# EAGLE design magspoof (EAGLE 7.7.0)
REV: 3
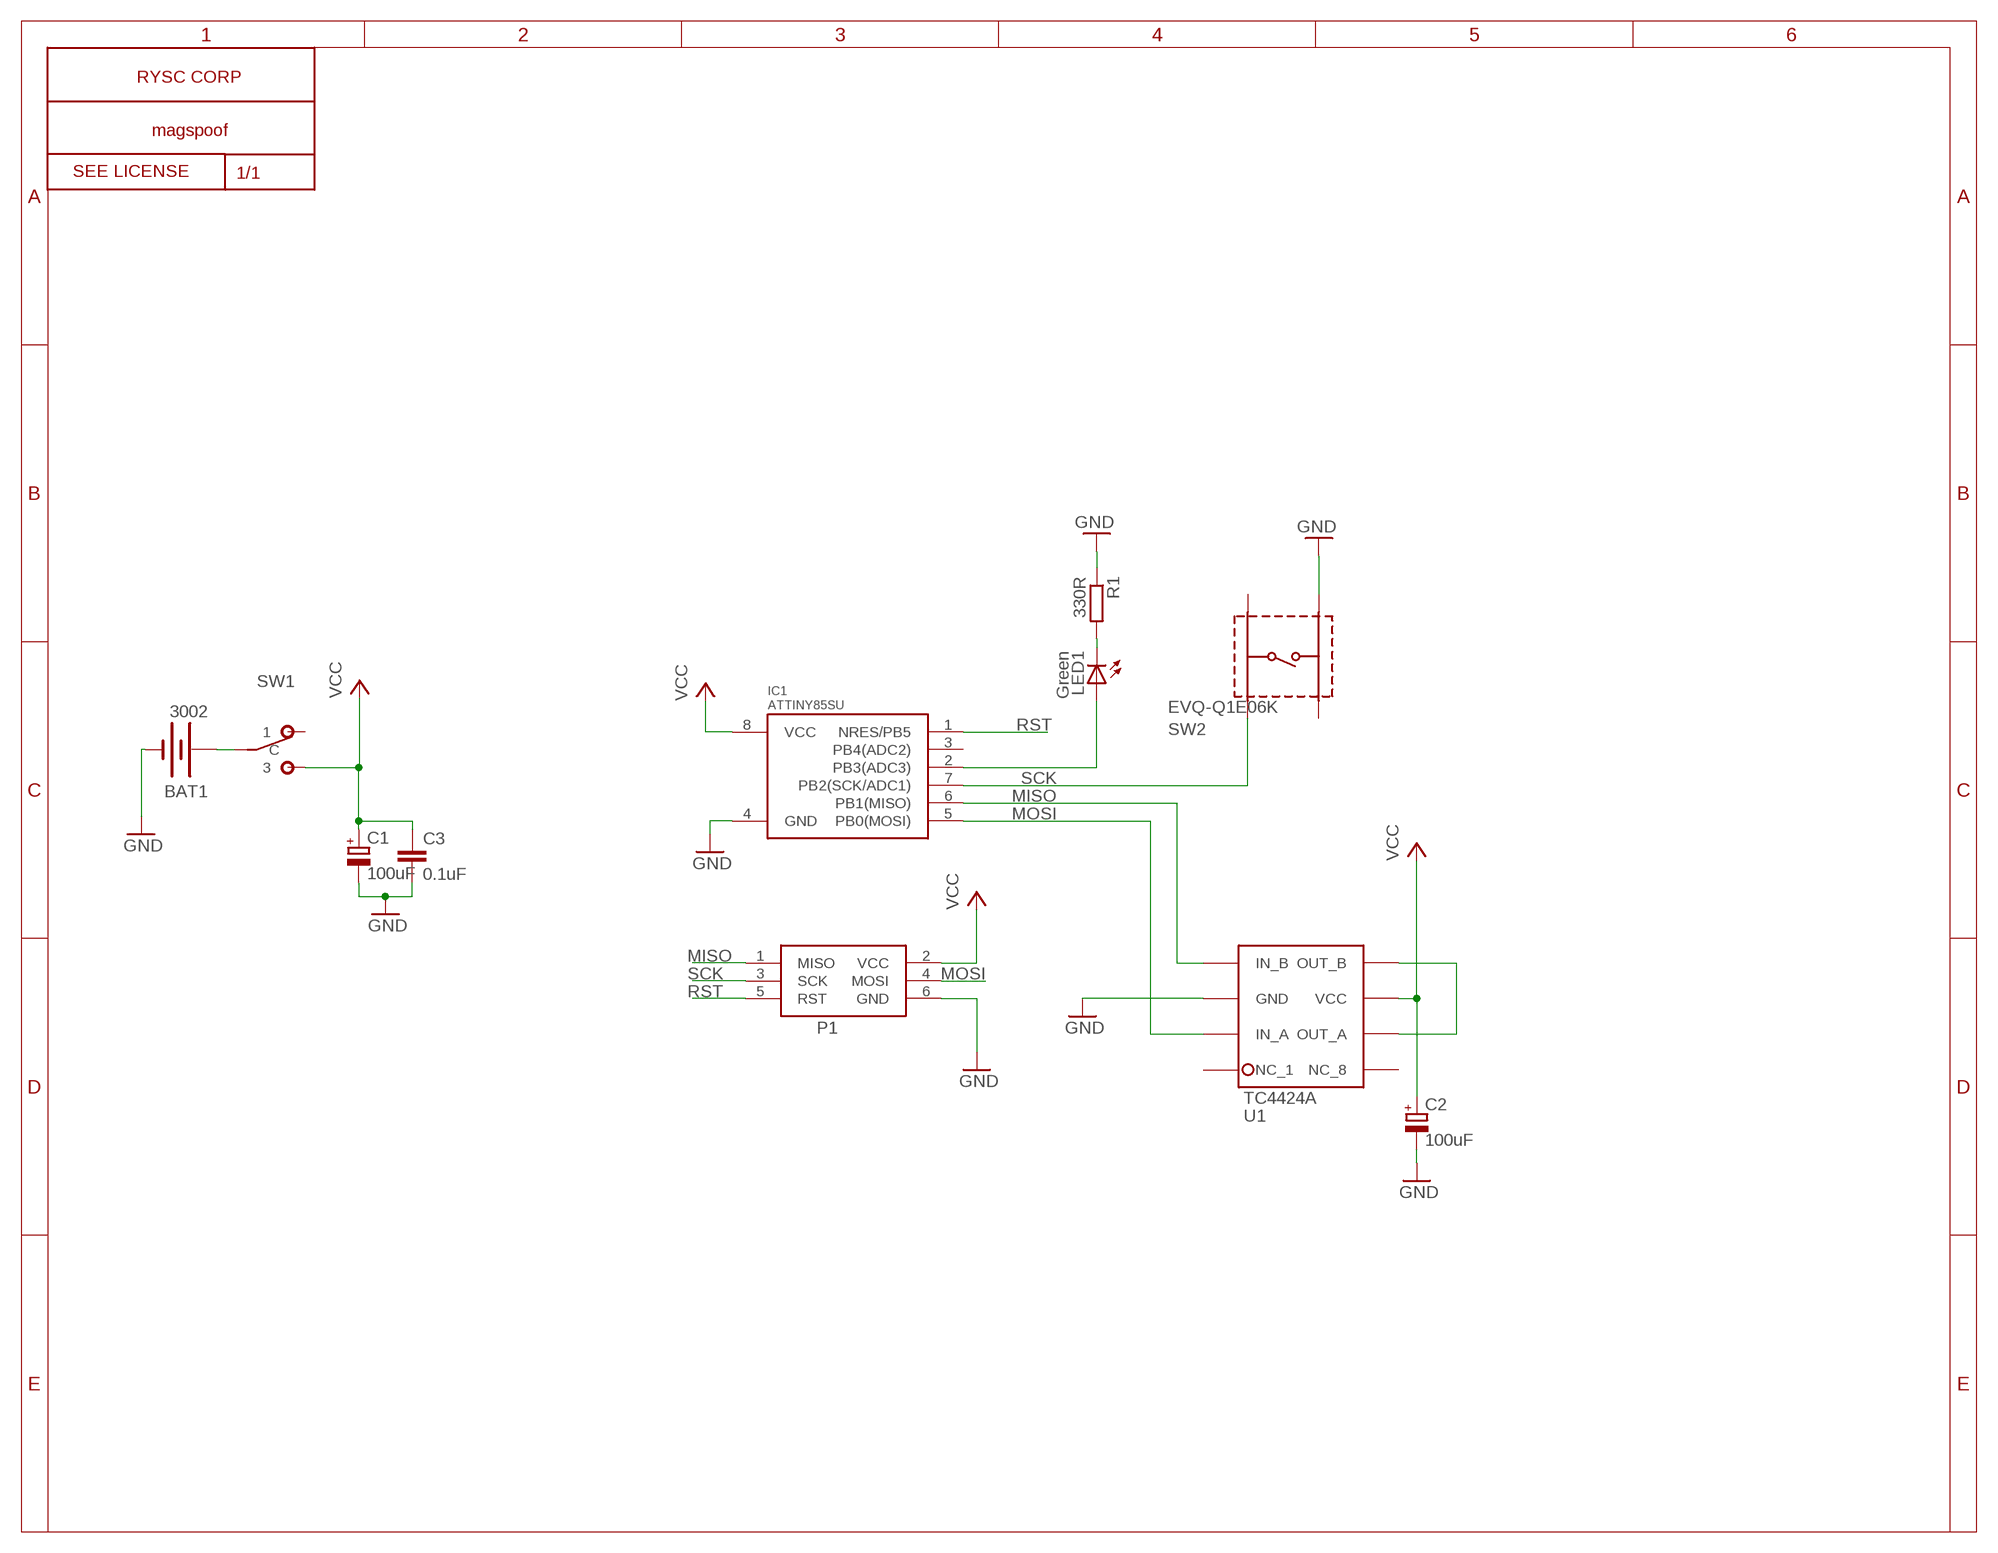
[diagram p0: schematic, sheet 1]

## Parts
BAT1  3002  [BATTCON_20MM]
C1  100uF  CPOL-EU  [C1411]
C2  100uF  CPOL-EU  [C1411]
C3  0.1uF  C-EUC0603  [C0603]
IC1  ATTINY85SU  [ATTINY85]
LED1  Green  LEDCHIPLED_0805  [CHIPLED_0805]
P1  AVRISP-6  [AVRISP]
R1  330R  R-EU_R0603  [R0603]
SW1  JS102011  [JS102011SAQN]
SW2  EVQ-Q1E06K  EVQQ1  [EVQQ1]
U1  TC4424A  [8-SOIC]

## Nets
ANTENNA: U1.5(OUT_B) U1.7(OUT_A)
GND: BAT1.- C1.P$2(-) C2.P$2(-) C3.2 IC1.4(GND) P1.6(GND) R1.1 SW2.D U1.3(GND)
MISO: IC1.6(PB1(MISO)) P1.1(MISO) U1.4(IN_B)
MOSI: IC1.5(PB0(MOSI)) P1.4(MOSI) U1.2(IN_A)
N$3: BAT1.+2(+) SW1.P$2(C)
N$4: IC1.2(PB3(ADC3)) LED1.A
N$10: LED1.C R1.2
RST: IC1.1(NRES/PB5) P1.5(RST)
SCK: IC1.7(PB2(SCK/ADC1)) P1.3(SCK) SW2.A
VCC: C1.P$1(+) C2.P$1(+) C3.1 IC1.8(VCC) P1.2(VCC) SW1.P$3 U1.6(VCC)
Unconnected: IC1.3(PB4(ADC2)) SW1.P$1 SW2.B SW2.C U1.1(NC_1) U1.8(NC_8)

## Library data of the parts
BAT1 = Keystone-3002:3002
C1 C2 = rcl:CPOL-EU: POLARIZED CAPACITOR, European symbol
C3 = rcl:C-EU: CAPACITOR, European symbol
IC1 = attiny85:ATTINY85
LED1 = led:LED: LED OSRAM: - CHIPLED LG R971, LG N971, LY N971, LG Q971, LY Q971, LO R971, LY R971 LH N974, LH R974 LS Q976, LO Q976, LY Q976 LO Q996 - Hyper CHIPLED LW Q18S LB Q993, LB Q99A, LB R99A - SideLED LS A670, LO A670, LY A670, LG A670, LP A670 LB A673, LV A673, LT A673, LW A673 LH A674 LY A675 LS A676, LA A676, LO A676, LY A676, LW A676 LS A679, LY A679, LG A679 - Hyper Micro SIDELED® LS Y876, LA Y876, LO Y876, LY Y876 LT Y87S - SmartLED LW L88C, LW L88S LB L89C, LB L89S, LG L890 LS L89K, LO L89K, LY L89K LS L896, LA L896, LO L896, LY L896 - TOPLED LS T670, LO T670, LY T670, LG T670, LP T670 LSG T670, LSP T670, LSY T670, LOP T670, LYG T670 LG T671, LOG T671, LSG T671 LB T673, LV T673, LT T673, LW T673 LH T674 LS T676, LA T676, LO T676, LY T676, LB T676, LH T676, LSB T676, LW T676 LB T67C, LV T67C, LT T67C, LS T67K, LO T67K, LY T67K, LW E67C LS E67B, LA E67B, LO E67B, LY E67B, LB E67C, LV E67C, LT E67C LW T67C LS T679, LY T679, LG T679 LS T770, LO T770, LY T770, LG T770, LP T770 LB T773, LV T773, LT T773, LW T773 LH T774 LS E675, LA E675, LY E675, LS T675 LS T776, LA T776, LO T776, LY T776, LB T776 LHGB T686 LT T68C, LB T68C - Hyper Mini TOPLED® LB M676 - Mini TOPLED Santana® LG M470 LS M47K, LO M47K, LY M47K Source: http://www.osram.convergy.de LUXEON: - LUMILED® LXK2-PW12-R00, LXK2-PW12-S00, LXK2-PW14-U00, LXK2-PW14-V00 LXK2-PM12-R00, LXK2-PM12-S00, LXK2-PM14-U00 LXK2-PE12-Q00, LXK2-PE12-R00, LXK2-PE12-S00, LXK2-PE14-T00, LXK2-PE14-U00 LXK2-PB12-K00, LXK2-PB12-L00, LXK2-PB12-M00, LXK2-PB14-N00, LXK2-PB14-P00, LXK2-PB14-Q00 LXK2-PR12-L00, LXK2-PR12-M00, LXK2-PR14-Q00, LXK2-PR14-R00 LXK2-PD12-Q00, LXK2-PD12-R00, LXK2-PD12-S00 LXK2-PH12-R00, LXK2-PH12-S00 LXK2-PL12-P00, LXK2-PL12-Q00, LXK2-PL12-R00 Source: www.luxeon.com KINGBRIGHT: KA-3528ASYC Source: www.kingbright.com
P1 = adafruit:AVRISP: AVR ISP HEADER Standard 6 pin header for AVR programming
R1 = rcl:R-EU_: RESISTOR, European symbol
SW1 = JS102011SAQN:JS102011
SW2 = EVQQ1:EVQQ1
U1 = TC4424A:TC4424A

## Board
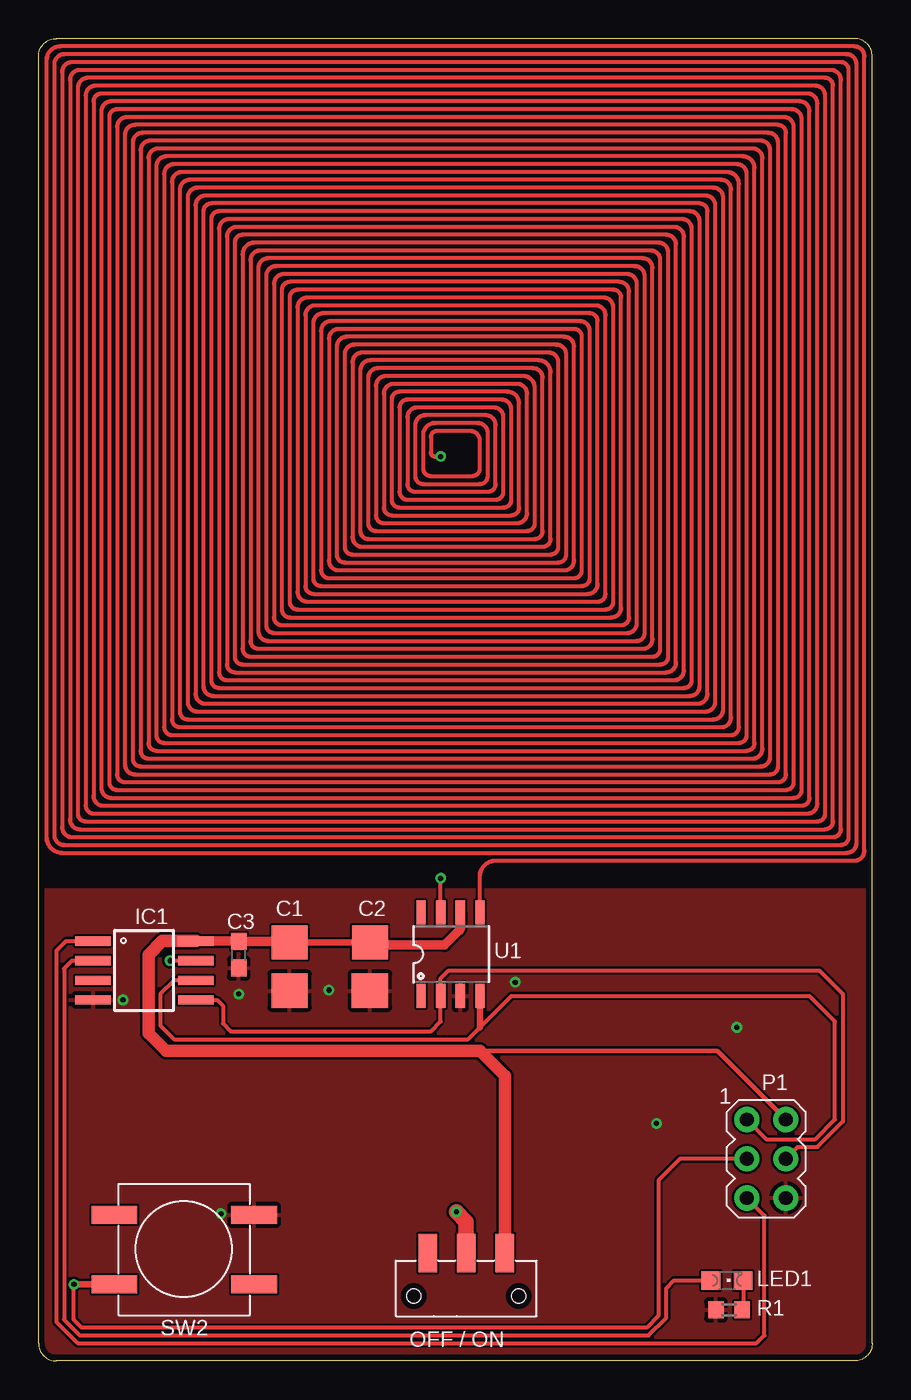
[diagram p1: board, top side]
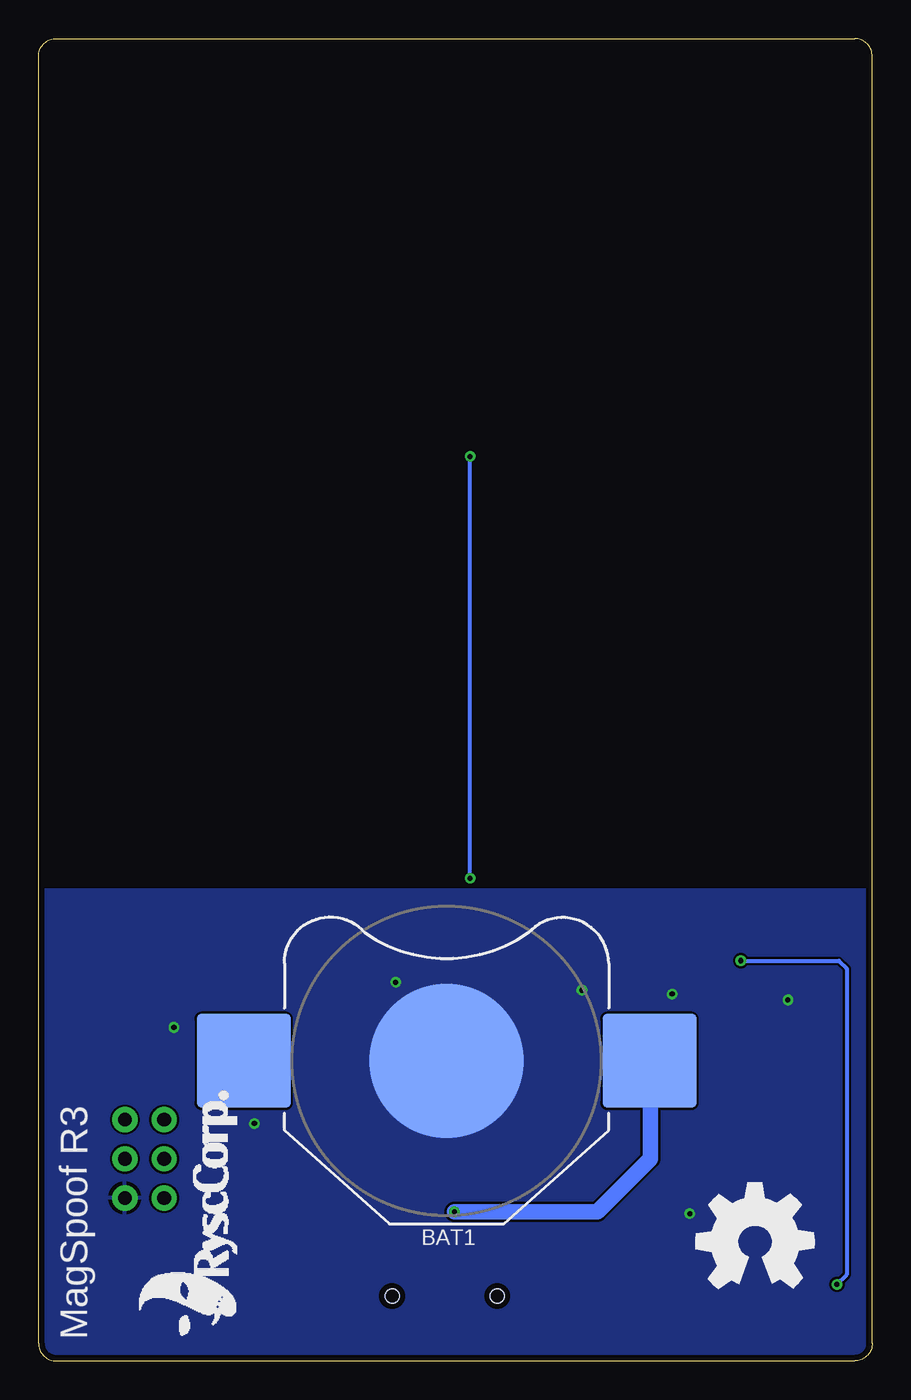
[diagram p2: board, bottom side, seen from below]

Size 53.98 x 85.6 mm. Coordinates in mm from the lower left corner, seen from the top.
Outline: 52.83,0 1.14,0 arc-90 0,1.14 0,84.45 arc-90 1.14,85.6 52.83,85.6 arc-90 53.98,84.45 53.98,1.14 arc-90 52.83,0
Copper layers (1*16): Top 0.0356mm / dielectric 1.5011mm / Bottom 0.0356mm
Design rules "LaenPCBOrder": minimum track width 6mil, minimum drill 13mil, track to track 6mil, track to pad 6mil, pad to pad 6mil, via to via 6mil, smd to smd 6mil, copper to edge 15mil, drill to drill 6mil, minimum pad ring 7mil, minimum via ring 7mil, stop-mask expansion 3mil, vias tented up to drill 0mil, thermal gap 10mil

### Footprints (pad centres in the part's own frame; a part is rotated, then mirrored left to right if it is on the bottom)
BATTCON_20MM = smd 6.07 x 6.07: +1 -13.135,0; +2 13.135,0 | smd 10 x 10: - 0,0
C1411 = smd 2.21 x 2.35: P$1 -1.561,0; P$2 1.564,-0.01
C0603 = smd 1.1 x 1: 1 -0.85,0; 2 0.85,0
ATTINY85 = smd 0.6 x 2.286: 1 -1.905,-3.33; 2 -0.635,-3.33; 3 0.635,-3.33; 4 1.905,-3.33; 5 1.905,3.33; 6 0.635,3.33; 7 -0.635,3.33; 8 -1.905,3.33
CHIPLED_0805 = smd 1.2 x 1.2: A 0,-1.05; C 0,1.05
AVRISP = drill 0.9 pad 1.626: 1 -1.27,2.54; 2 1.27,2.54; 3 -1.27,0; 4 1.27,0; 5 -1.27,-2.54; 6 1.27,-2.54
R0603 = smd 1 x 1.1: 1 -0.85,0; 2 0.85,0
JS102011SAQN = smd 1.2 x 2.5: P$1 -2.5,2.8; P$2 0,2.8; P$3 2.5,2.8 | hole 0.9: -3.4,0; 3.4,0
EVQQ1 = smd 2.95 x 1.15: A -4.494,-2.286; B 4.556,-2.286; C -4.494,2.214; D 4.556,2.214
8-SOIC = smd 0.6 x 1.55: 1 -1.905,-2.667; 2 -0.635,-2.667; 3 0.635,-2.667; 4 1.905,-2.667; 5 1.905,2.733; 6 0.635,2.733; 7 -0.635,2.733; 8 -1.905,2.733

### Placement (x,y rotation side)
BAT1  27.56,19.43 0 bottom
C1  16.26,25.53 270 top
C2  21.46,25.53 270 top
C3  12.95,26.29 270 top
IC1  6.86,25.27 270 top
LED1  44.58,5.21 270 top
P1  47.12,13.08 0 top
R1  44.7,3.3 0 top
SW1  27.69,4.19 0 top
SW2  9.4,7.24 0 top
U1  26.67,26.29 0 top

### Tracks (layer width: path | path; a pad name or v marks a point on that pad's centre or on a via)
ANTENNA  (via drill 0.33)
  Top 0.254: v26.04,58.55 25.65,58.55 arc-90 25.4,58.8 25.4,59.82 arc-90 25.78,60.2 27.94,60.2 arc-90 28.57,59.56 28.57,57.78 arc-90 28.07,57.28 25.4,57.28 arc-90 24.89,57.78 24.89,59.94 arc-90 25.65,60.71 28.45,60.71 arc-90 29.08,60.07 29.08,57.28 arc-90 28.57,56.77 24.89,56.77 arc-90 24.38,57.28 24.38,60.58 arc-90 25.02,61.21 28.96,61.21 arc-90 29.59,60.58 29.59,56.77 arc-90 29.08,56.26 24.38,56.26 arc-90 23.88,56.77 23.88,61.09 arc-90 24.51,61.72 29.46,61.72 arc-90 30.1,61.09 30.1,56.26 arc-90 29.59,55.75 23.88,55.75 arc-90 23.37,56.26 23.37,61.72 arc-90 23.88,62.23 29.97,62.23 arc-90 30.61,61.59 30.61,55.75 arc-90 30.1,55.24 23.37,55.24 arc-90 22.86,55.75 22.86,62.23 arc-90 23.37,62.74 30.35,62.74 arc-90 31.11,61.98 31.11,55.24 arc-90 30.61,54.74 22.86,54.74 arc-90 22.35,55.24 22.35,62.61 arc-90 22.99,63.25 30.99,63.25 arc-90 31.62,62.61 31.62,54.86 arc-90 30.99,54.23 22.35,54.23 arc-90 21.84,54.74 21.84,63.12 arc-90 22.48,63.75 31.37,63.75 arc-90 32.13,62.99 32.13,54.23 arc-90 31.62,53.72 21.84,53.72 arc-90 21.34,54.23 21.34,63.63 arc-90 21.97,64.26 32,64.26 arc-90 32.64,63.63 32.64,53.72 arc-90 32.13,53.21 21.34,53.21 arc-90 20.83,53.72 20.83,64.14 arc-90 21.46,64.77 32.38,64.77 arc-90 33.15,64.01 33.15,53.21 arc-90 32.64,52.7 20.95,52.7 arc-90 20.32,53.34 20.32,64.64 arc-90 20.95,65.28 33.02,65.28 arc-90 33.66,64.64 33.66,52.7 arc-90 33.15,52.2 20.32,52.2 arc-90 19.81,52.7 19.81,65.15 arc-90 20.45,65.79 33.53,65.79 arc-90 34.16,65.15 34.16,52.2 arc-90 33.66,51.69 19.81,51.69 arc-90 19.3,52.2 19.3,65.66 arc-90 19.94,66.29 34.04,66.29 arc-90 34.67,65.66 34.67,51.82 arc-90 34.04,51.18 19.43,51.18 arc-90 18.8,51.82 18.8,66.17 arc-90 19.43,66.8 34.67,66.8 arc-90 35.18,66.29 35.18,51.18 arc-90 34.67,50.67 18.8,50.67 arc-90 18.29,51.18 18.29,66.67 arc-90 18.92,67.31 35.05,67.31 arc-90 35.69,66.67 35.69,50.67 arc-90 35.18,50.16 18.29,50.16 arc-90 17.78,50.67 17.78,67.18 arc-90 18.41,67.82 35.69,67.82 arc-90 36.2,67.31 36.2,50.29 arc-90 35.56,49.66 17.78,49.66 arc-90 17.27,50.16 17.27,67.69 arc-90 17.91,68.33 36.07,68.33 arc-90 36.7,67.69 36.7,49.66 arc-90 36.2,49.15 17.4,49.15 arc-90 16.76,49.78 16.76,68.2 arc-90 17.4,68.83 36.58,68.83 arc-90 37.21,68.2 37.21,49.15 arc-90 36.7,48.64 16.76,48.64 arc-90 16.26,49.15 16.26,68.83 arc-90 16.76,69.34 37.21,69.34 arc-90 37.72,68.83 37.72,48.77 arc-90 37.08,48.13 16.26,48.13 arc-90 15.75,48.64 15.75,69.34 arc-90 16.26,69.85 37.59,69.85 arc-90 38.23,69.22 38.23,48.13 arc-90 37.72,47.62 15.75,47.62 arc-90 15.24,48.13 15.24,69.72 arc-90 15.88,70.36 38.1,70.36 arc-90 38.73,69.72 38.73,47.75 arc-90 38.1,47.12 15.24,47.12 arc-90 14.73,47.62 14.73,70.23 arc-90 15.37,70.87 38.61,70.87 arc-90 39.24,70.23 39.24,47.12 arc-90 38.73,46.61 14.86,46.61 arc-90 14.22,47.24 14.22,70.74 arc-90 14.86,71.37 39.12,71.37 arc-90 39.75,70.74 39.75,46.74 arc-90 39.12,46.1 14.22,46.1 arc-90 13.72,46.61 13.72,71.25 arc-90 14.35,71.88 39.62,71.88 arc-90 40.26,71.25 40.26,46.1 arc-90 39.75,45.59 13.72,45.59 arc-90 13.21,46.1 13.21,71.63 arc-90 13.97,72.39 40.13,72.39 arc-90 40.77,71.75 40.77,45.59 arc-90 40.26,45.09 13.21,45.09 arc-90 12.7,45.59 12.7,72.39 arc-90 13.21,72.9 40.64,72.9 arc-90 41.27,72.26 41.27,45.21 arc-90 40.64,44.58 12.7,44.58 arc-90 12.19,45.09 12.19,72.77 arc-90 12.83,73.41 41.15,73.41 arc-90 41.78,72.77 41.78,44.7 arc-90 41.15,44.07 12.19,44.07 arc-90 11.68,44.58 11.68,73.28 arc-90 12.32,73.91 41.66,73.91 arc-90 42.29,73.28 42.29,44.07 arc-90 41.78,43.56 11.68,43.56 arc-90 11.18,44.07 11.18,73.91 arc-90 11.68,74.42 42.16,74.42 arc-90 42.8,73.79 42.8,43.69 arc-90 42.16,43.05 11.3,43.05 arc-90 10.67,43.69 10.67,74.42 arc-90 11.18,74.93 42.8,74.93 arc-90 43.31,74.42 43.31,43.18 arc-90 42.67,42.55 10.79,42.55 arc-90 10.16,43.18 10.16,74.8 arc-90 10.79,75.44 43.18,75.44 arc-90 43.81,74.8 43.81,42.67 arc-90 43.18,42.04 10.29,42.04 arc-90 9.65,42.67 9.65,75.31 arc-90 10.29,75.95 43.69,75.95 arc-90 44.32,75.31 44.32,42.16 arc-90 43.69,41.53 9.65,41.53 arc-90 9.14,42.04 9.14,75.82 arc-90 9.78,76.45 44.2,76.45 arc-90 44.83,75.82 44.83,41.66 arc-90 44.2,41.02 9.14,41.02 arc-90 8.64,41.53 8.64,76.33 arc-90 9.27,76.96 44.58,76.96 arc-90 45.34,76.2 45.34,41.02 arc-90 44.83,40.51 8.64,40.51 arc-90 8.13,41.02 8.13,76.83 arc-90 8.76,77.47 45.21,77.47 arc-90 45.85,76.83 45.85,40.51 arc-90 45.34,40.01 8.13,40.01 arc-90 7.62,40.51 7.62,77.34 arc-90 8.26,77.98 45.59,77.98 arc-90 46.35,77.22 46.35,40.01 arc-90 45.85,39.5 7.62,39.5 arc-90 7.11,40.01 7.11,77.85 arc-90 7.75,78.49 46.23,78.49 arc-90 46.86,77.85 46.86,39.62 arc-90 46.23,38.99 7.11,38.99 arc-90 6.6,39.5 6.6,78.36 arc-90 7.24,78.99 46.74,78.99 arc-90 47.37,78.36 47.37,39.12 arc-90 46.74,38.48 6.6,38.48 arc-90 6.1,38.99 6.1,78.87 arc-90 6.73,79.5 47.24,79.5 arc-90 47.88,78.87 47.88,38.48 arc-90 47.37,37.97 6.22,37.97 arc-90 5.59,38.61 5.59,79.38 arc-90 6.22,80.01 47.88,80.01 arc-90 48.39,79.5 48.39,37.97 arc-90 47.88,37.47 5.59,37.47 arc-90 5.08,37.97 5.08,79.88 arc-90 5.71,80.52 48.26,80.52 arc-90 48.9,79.88 48.9,37.47 arc-90 48.39,36.96 5.08,36.96 arc-90 4.57,37.47 4.57,80.52 arc-90 5.08,81.03 48.77,81.03 arc-90 49.4,80.39 49.4,36.96 arc-90 48.9,36.45 4.7,36.45 arc-90 4.06,37.08 4.06,80.9 arc-90 4.7,81.53 49.28,81.53 arc-90 49.91,80.9 49.91,36.45 arc-90 49.4,35.94 4.19,35.94 arc-90 3.56,36.58 3.56,81.53 arc-90 4.06,82.04 49.78,82.04 arc-90 50.42,81.41 50.42,36.07 arc-90 49.78,35.43 3.56,35.43 arc-90 3.05,35.94 3.05,81.92 arc-90 3.68,82.55 50.29,82.55 arc-90 50.93,81.92 50.93,35.43 arc-90 50.42,34.92 3.05,34.92 arc-90 2.54,35.43 2.54,82.42 arc-90 3.17,83.06 50.93,83.06 arc-90 51.44,82.55 51.44,34.92 arc-90 50.93,34.42 2.67,34.42 arc-90 2.03,35.05 2.03,82.93 arc-90 2.67,83.57 51.31,83.57 arc-90 51.94,82.93 51.94,34.42 arc-90 51.44,33.91 2.16,33.91 arc-90 1.52,34.54 1.52,83.44 arc-90 2.16,84.07 51.94,84.07 arc-90 52.45,83.57 52.45,33.91 arc-90 51.94,33.4 1.65,33.4 arc-90 1.02,34.04 1.02,83.95 arc-90 1.65,84.58 52.32,84.58 arc-90 52.96,83.95 52.96,33.53 arc-90 52.32,32.89 1.52,32.89 arc-90 0.51,33.91 0.51,84.2 arc-90 1.4,85.09 52.83,85.09 arc-90 53.47,84.45 53.47,33.02 arc-90 52.83,32.38 29.59,32.38 arc90 28.57,31.37 U1.5
  Top 0.254: U1.7 v26.04,31.24
  Bottom 0.254: v26.04,31.24 v26.04,58.55
GND  (via drill 0.33 pad 0.15)
  other vias: 40.01,15.37 30.86,24.51 11.81,9.53 5.46,23.37 18.8,24 45.21,21.59 12.95,23.75
  pour Top: -9.65,30.48 63.5,30.48 62.74,-9.02 -9.78,-9.02
  pour Bottom: 63.5,30.48 -9.02,30.48 -9.27,-5.97 63.25,-5.97
MISO
  Top 0.254: IC1.6 8.76,24.64 7.87,23.75 7.87,21.72 8.76,20.83 27.81,20.83 28.57,21.59 30.61,23.62 49.91,23.62 51.56,21.97 51.56,15.62 50.29,14.35 47.12,14.35 P1.1
  Top 0.406: 28.57,21.59 U1.4
MOSI
  Top 0.254: IC1.5 11.56,23.37 11.94,22.99 11.94,21.84 12.45,21.34 25.4,21.34 26.04,21.97 U1.2 26.04,24.77 26.54,25.27 50.55,25.27 52.07,23.75 52.07,15.49 50.42,13.84 49.15,13.84 P1.4
N$3  (via drill 0.33)
  Top 1.016: SW1.P$2 27.69,9.02 v27.05,9.65
  Bottom 1.016: v27.05,9.65 17.78,9.65 14.35,13.08 14.35,19.36 BAT1.+2
N$4
  Top 0.254: LED1.A 41.15,5.21 40.64,4.7 40.64,2.79 39.5,1.65 2.67,1.65 1.65,2.67 1.65,25.4 2.16,25.91 IC1.2
N$10
  Top 0.254: LED1.C 45.63,3.48 arc-45 R1.2
RST
  Top 0.254: P1.5 46.99,9.4 46.99,1.65 46.48,1.14 2.54,1.14 1.14,2.54 1.14,26.54 1.78,27.18 IC1.1
SCK  (via drill 0.33 pad 0.15)
  Top 0.254: IC1.7 v8.51,25.91 | P1.3 41.53,13.08 40.13,11.68 40.13,2.92 39.37,2.16 2.79,2.16 2.29,2.67 v2.29,4.95
  Top 0.406: SW2.A v2.29,4.95
  Bottom 0.254: v8.51,25.91 2.16,25.91 1.65,25.4 1.65,5.59 v2.29,4.95
VCC
  Top 0.305: P1.2 43.94,20.07 28.57,20.07
  Top 0.406: C1.P$1 C2.P$1 | C3.1 12.91,27.18 11.43,27.18
  Top 0.61: U1.6 27.3,28.05 arc-45 27.23,27.87 26.29,26.92 21.73,26.92 arc-45 21.55,27 C2.P$1 | IC1.8 11.43,27.18 12.86,27.18 | C3.1 16.13,27.14 arc-45 C1.P$1
  Top 0.813: IC1.8 8,27.18 7.11,26.29 7.11,21.21 8.26,20.07 28.57,20.07 30.19,18.45 SW1.P$3

### Text on the board
tNames: OFF / ON
bNames: MagSpoof R3